# Altium schematic sheet RADC-Master-S00-V00.SchDoc: RADC Master (Top Level)
size A3; DrawnBy: Jonn Dillon; DocumentNumber: 1; SheetNumber: 1; SheetTotal: 8; Version: 00; Project: QUTMS RADIO COMPUTE; PageSetup: Record=PageOptions|CenterHorizontal=True|CenterVertical=True|PrintScale=0.97|XCorrection=1.00|YCorrection=1.00|PrintKind=0|BorderSize=5000000|LeftOffset=0|BottomOffset=0|Orientation=2|PaperLength=1000|PaperWidth=1000|Scale=100|PaperSource=7|PrintQuality=-4|MediaType=1|DitherType=10|PaperKind=A4|PrintScaleMode=1
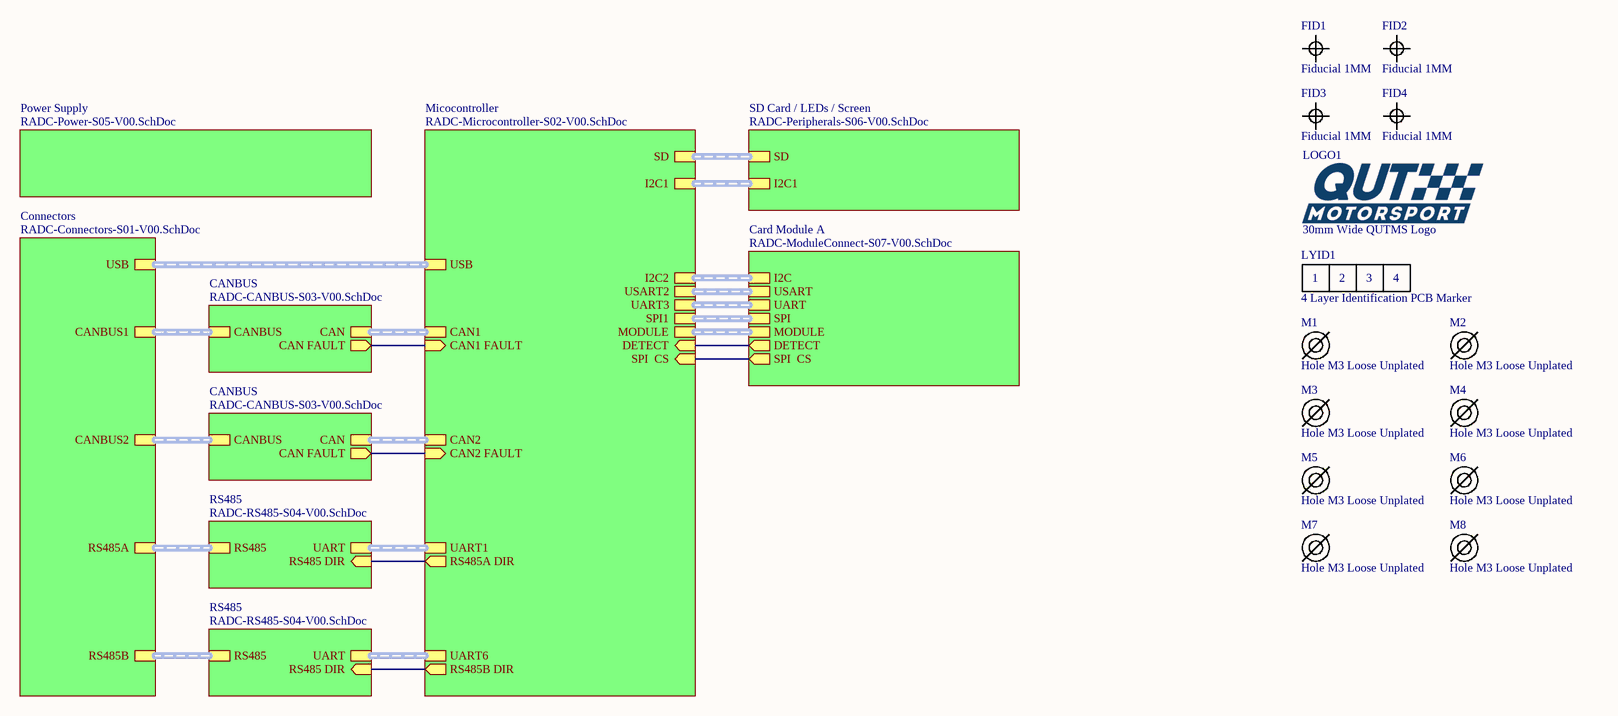
[diagram p0: RADC-Master-S00-V00.SchDoc]

## Parts
FID1  Fiducial 1MM  [FIDUCIAL 1MM]  (no BOM)
FID2  Fiducial 1MM  [FIDUCIAL 1MM]  (no BOM)
FID3  Fiducial 1MM  [FIDUCIAL 1MM]  (no BOM)
FID4  Fiducial 1MM  [FIDUCIAL 1MM]  (no BOM)
LOGO1  30mm Wide QUTMS Logo  [QUTMS LOGO 30MM]  (no BOM)
LYID1  4 Layer Identification PCB Marker  [LAYER IDENT 4]  (no BOM)
M1  Hole M3 Loose Unplated  [M3.5 UNPLATED]  (no BOM)
M2  Hole M3 Loose Unplated  [M3.5 UNPLATED]  (no BOM)
M3  Hole M3 Loose Unplated  [M3.5 UNPLATED]  (no BOM)
M4  Hole M3 Loose Unplated  [M3.5 UNPLATED]  (no BOM)
M5  Hole M3 Loose Unplated  [M3.5 UNPLATED]  (no BOM)
M6  Hole M3 Loose Unplated  [M3.5 UNPLATED]  (no BOM)
M7  Hole M3 Loose Unplated  [M3.5 UNPLATED]  (no BOM)
M8  Hole M3 Loose Unplated  [M3.5 UNPLATED]  (no BOM)

## Sub-sheets
CANBUS = RADC-CANBUS-S03-V00.SchDoc: CAN (harness CAN), CANBUS (harness CANBUS), CAN FAULT (out)
CANBUS = RADC-CANBUS-S03-V00.SchDoc: CAN (harness CAN), CANBUS (harness CANBUS), CAN FAULT (out)
Card Module A = RADC-ModuleConnect-S07-V00.SchDoc: I2C (harness I2C), USART (harness USART), UART (harness UART), SPI (harness SPI), MODULE (harness MODULE), DETECT (out), SPI  CS (out)
Connectors = RADC-Connectors-S01-V00.SchDoc: USB (harness USB), CANBUS2 (harness CANBUS), CANBUS1 (harness CANBUS), RS485A (harness RS485), RS485B (harness RS485)
Micocontroller = RADC-Microcontroller-S02-V00.SchDoc: USB, SD, CAN1, CAN2, I2C2 (harness I2C), USART2 (harness USART), SPI1 (harness SPI), MODULE, UART1, UART3 (harness UART), UART6 (harness UART), DETECT (in), RS485A DIR (out), RS485B DIR (out), SPI  CS (in), CAN1 FAULT (in), CAN2 FAULT (in), I2C1 (harness I2C)
Power Supply = RADC-Power-S05-V00.SchDoc: no entries
RS485 = RADC-RS485-S04-V00.SchDoc: RS485 DIR (in), RS485 (harness RS485), UART (harness UART)
RS485 = RADC-RS485-S04-V00.SchDoc: RS485 DIR (in), RS485 (harness RS485), UART (harness UART)
SD Card / LEDs / Screen = RADC-Peripherals-S06-V00.SchDoc: SD (harness SD), I2C1 (harness I2C)

## Nets
(unnamed): sheet Micocontroller/DETECT, sheet Card Module A/DETECT
(unnamed): sheet Micocontroller/RS485A DIR, sheet RS485/RS485 DIR
(unnamed): sheet Micocontroller/RS485B DIR, sheet RS485/RS485 DIR
(unnamed): sheet Micocontroller/SPI  CS, sheet Card Module A/SPI  CS
(unnamed): sheet Micocontroller/CAN1 FAULT, sheet CANBUS/CAN FAULT
(unnamed): sheet Micocontroller/CAN2 FAULT, sheet CANBUS/CAN FAULT

## Buses and harness runs
harness sheet CANBUS/CAN = sheet Micocontroller/CAN1
harness sheet CANBUS/CAN = sheet Micocontroller/CAN2
harness sheet CANBUS/CANBUS = sheet Connectors/CANBUS1
harness sheet CANBUS/CANBUS = sheet Connectors/CANBUS2
harness sheet Card Module A/I2C = sheet Micocontroller/I2C2
harness sheet Card Module A/MODULE = sheet Micocontroller/MODULE
harness sheet Card Module A/SPI = sheet Micocontroller/SPI1
harness sheet Card Module A/UART = sheet Micocontroller/UART3
harness sheet Card Module A/USART = sheet Micocontroller/USART2
harness sheet Connectors/RS485A = sheet RS485/RS485
harness sheet Connectors/RS485B = sheet RS485/RS485
harness sheet Connectors/USB = sheet Micocontroller/USB
harness sheet Micocontroller/I2C1 = sheet SD Card / LEDs / Screen/I2C1
harness sheet Micocontroller/SD = sheet SD Card / LEDs / Screen/SD
harness sheet Micocontroller/UART1 = sheet RS485/UART
harness sheet Micocontroller/UART6 = sheet RS485/UART

## Notes on the sheet
- Revision History:
- Sheet Title:
- Rev
- Date
- Description
- Project:
- Size:
- Drawn By:
- A3
- Number:
- Revision:
- Sheet
- Version:
- of
- QUT Motorsport
- O-120, Gardens Point
- 2 George Street
- Brisbane, QLD 4000
- Australia
- Print Date:
- Print Time:
- File Name:
- (in symbol Layer Identification 4) 1; 2; 3; 4

## Library data of the parts
LOGO1 = QUTMS Logo 30mm
LYID1 = Layer Identification 4
M1-M8 = Hole M3 Loose Unplated: M3.5 Hole, No Plating